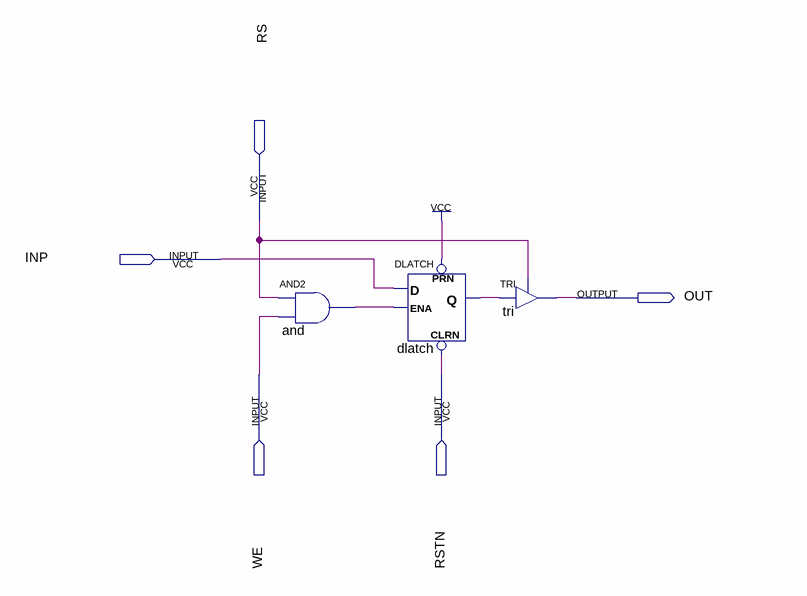
[diagram p0: schematic sheet]
// Quartus schematic MCELL.bdf as structural Verilog: 3 symbols, 5 pins
module MCELL (
  input  RS,
  input  INP,
  input  WE,
  input  RSTN,
  output OUT
);

  wire and_out, dlatch_q;

  and \and  (and_out, RS, WE);
  DLATCH dlatch (.CLRN(RSTN), .D(INP), .ENA(and_out), .PRN(1'b1), .Q(dlatch_q));
  TRI \tri  (.IN(dlatch_q), .OE(RS), .OUT(OUT));
endmodule
